# Altium schematic sheet Evb board STM32H7 Fullcolor V1l0 Project.SchDoc
size A3; CompanyName: FEDEVEL; Organization: FEDEVEL; DocumentNumber: 1; Revision: V1I1; SheetNumber: 10; SheetTotal: 10; PageSetup: Record=PageOptions|CenterHorizontal=True|CenterVertical=True|PrintScale=1.07|XCorrection=1.00|YCorrection=1.00|PrintKind=1|BorderSize=5000000|LeftOffset=0|BottomOffset=0|Orientation=2|PaperLength=1000|PaperWidth=1000|Scale=100|PaperSource=7|PrintQuality=600|MediaType=1|DitherType=10|PaperKind=A3|PrintScaleMode=1; ProjectName: KDS C6A816x Module
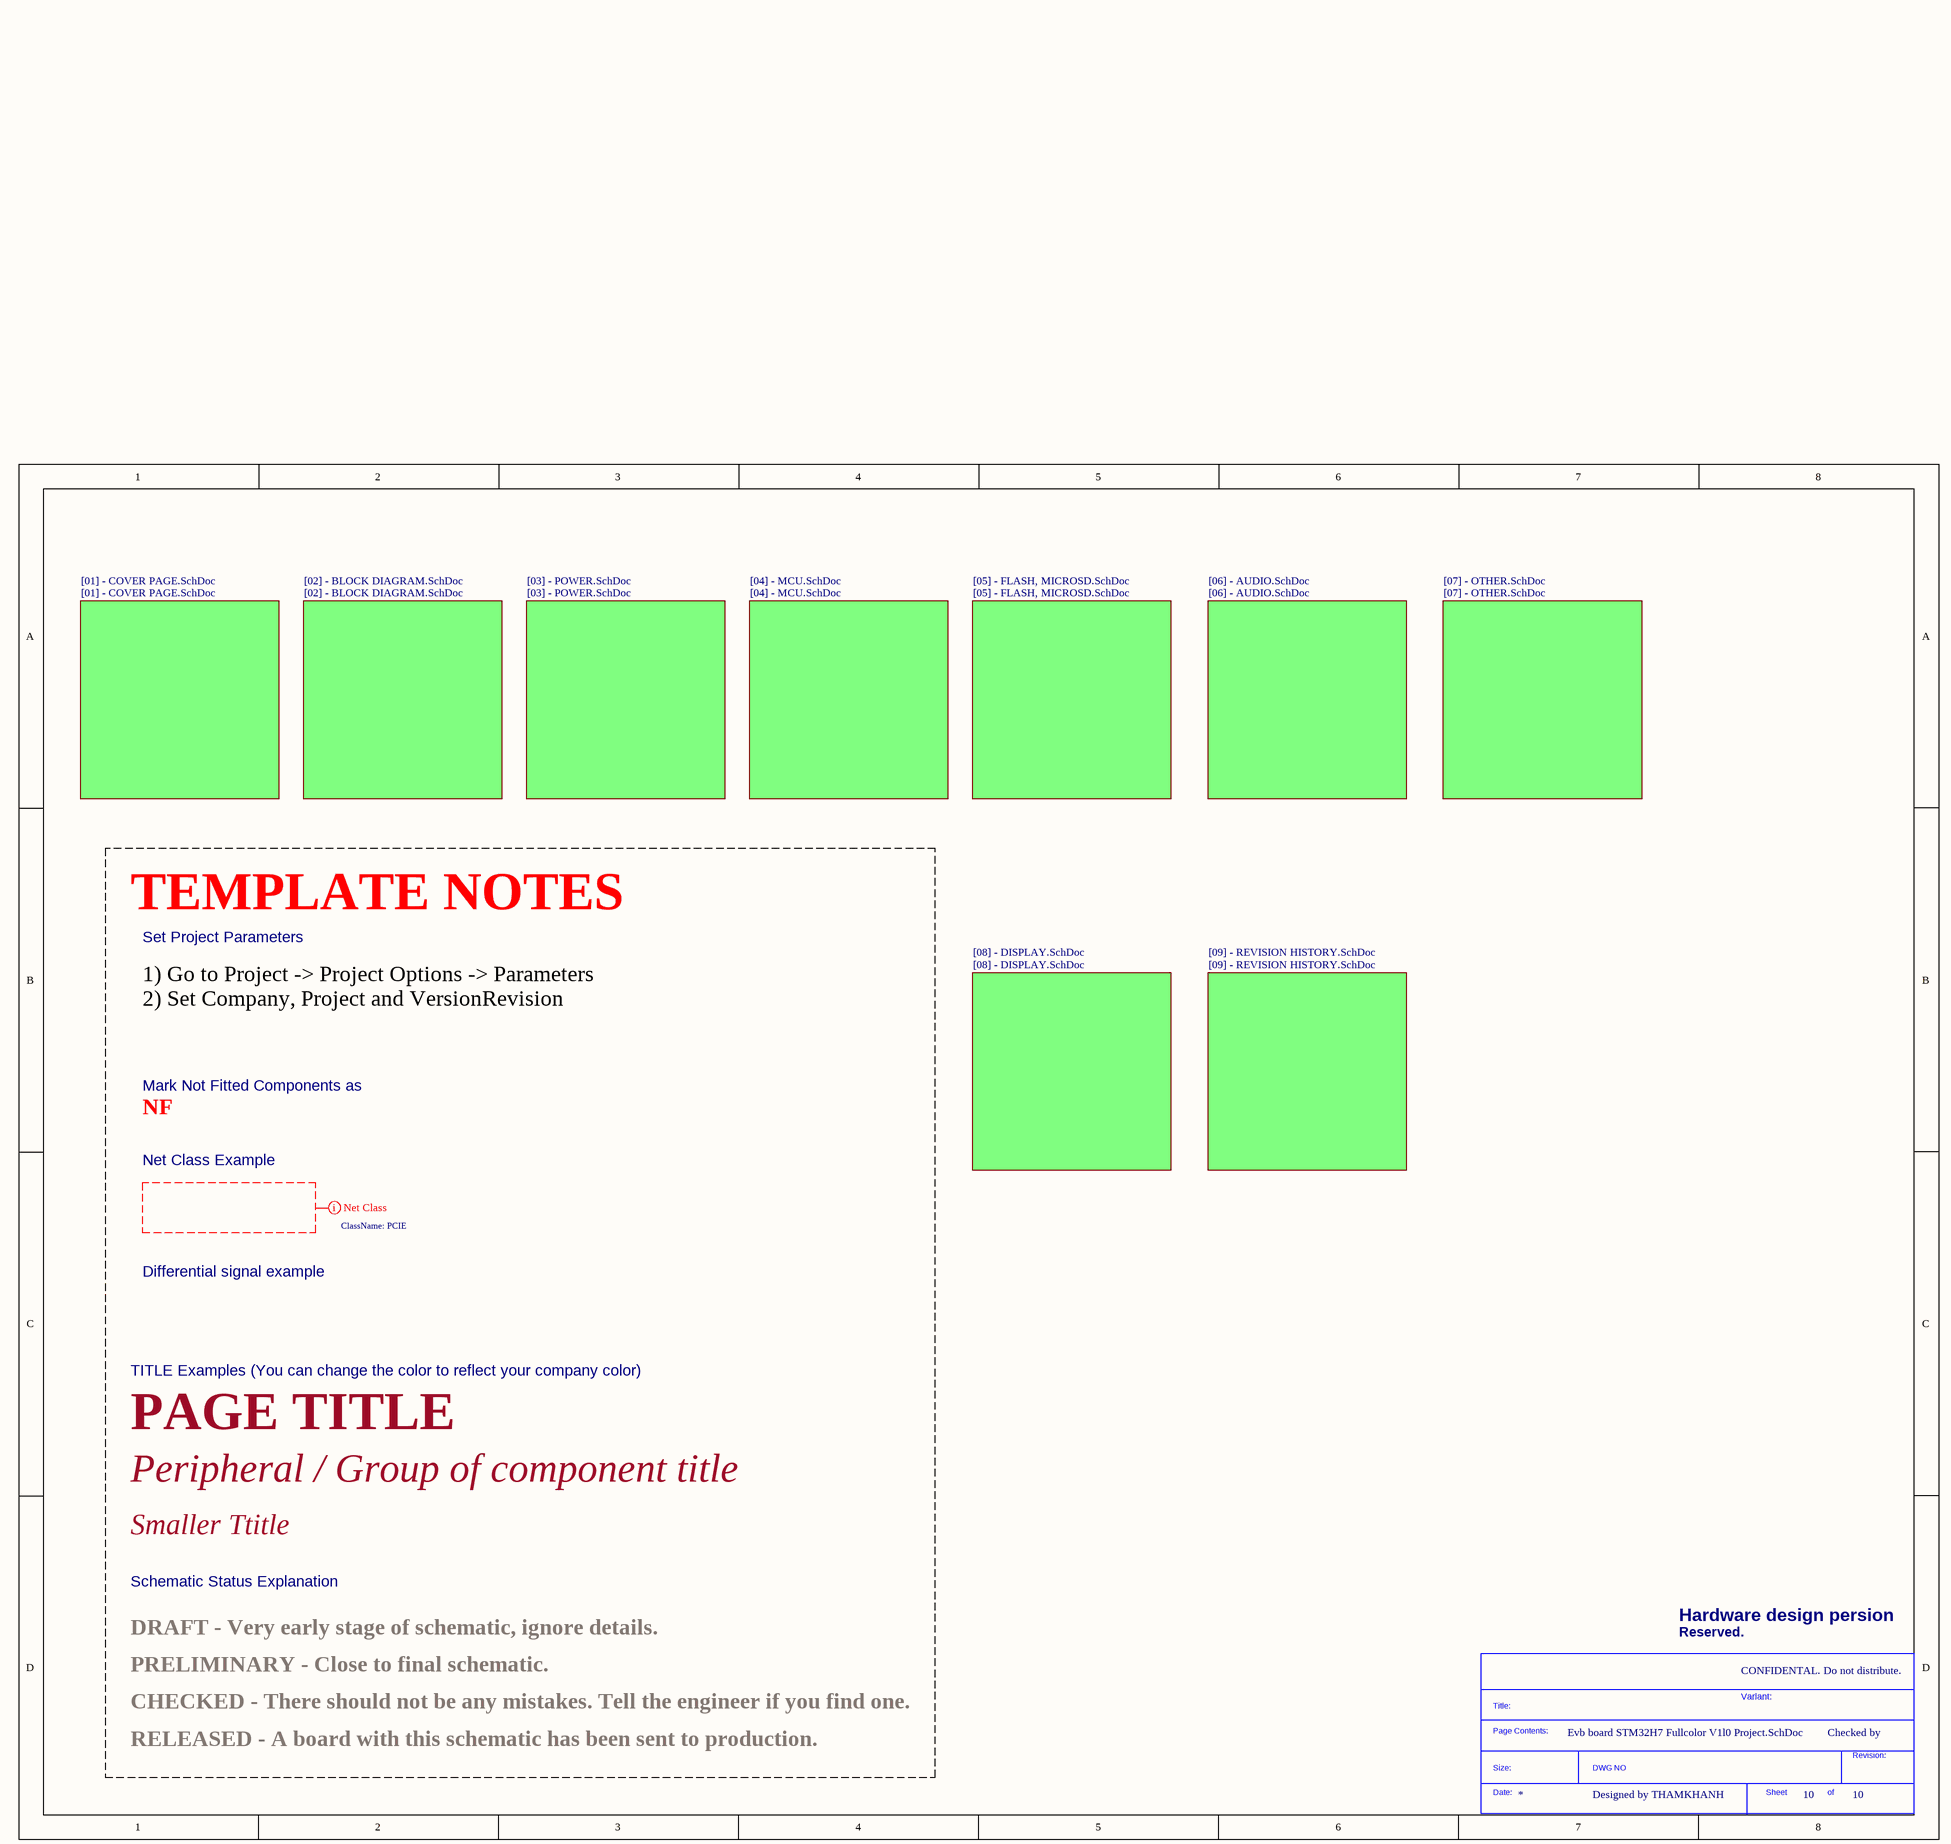
[diagram p0: Evb board STM32H7 Fullcolor V1l0 Project.SchDoc]

## Parts
*  SDTitleBlock  (value not drawn)  (graphical)

## Sub-sheets
[01] - COVER PAGE.SchDoc = [01] - COVER PAGE.SchDoc: no entries
[02] - BLOCK DIAGRAM.SchDoc = [02] - BLOCK DIAGRAM.SchDoc: no entries
[03] - POWER.SchDoc = [03] - POWER.SchDoc: no entries
[04] - MCU.SchDoc = [04] - MCU.SchDoc: no entries
[05] - FLASH, MICROSD.SchDoc = [05] - FLASH, MICROSD.SchDoc: no entries
[06] - AUDIO.SchDoc = [06] - AUDIO.SchDoc: no entries
[07] - OTHER.SchDoc = [07] - OTHER.SchDoc: no entries
[08] - DISPLAY.SchDoc = [08] - DISPLAY.SchDoc: no entries
[09] - REVISION HISTORY.SchDoc = [09] - REVISION HISTORY.SchDoc: no entries

## Layout directives
net class PCIE: (no net found under the mark)

## Notes on the sheet
- TEMPLATE NOTES
- Set Project Parameters
- 1) Go to Project -> Project Options -> Parameters
  2) Set Company, Project and VersionRevision
- NF
- Mark Not Fitted Components as
- Net Class Example
- Differential signal example
- TITLE Examples (You can change the color to reflect your company color)
- PAGE TITLE
- Peripheral / Group of component title
- Smaller Ttitle
- Schematic Status Explanation
- Hardware design persion
- PRELIMINARY - Close to final schematic.
- DRAFT - Very early stage of schematic, ignore details.
- Reserved.
- CONFIDENTAL. Do not distribute.
- CHECKED - There should not be any mistakes. Tell the engineer if you find one.
- Variant:
- Checked by
- RELEASED - A board with this schematic has been sent to production.
- Designed by THAMKHANH
- (in symbol SDTitleBlock) Title:; Page Contents:; Revision:; Size:; DWG NO; Date:; Sheet; of